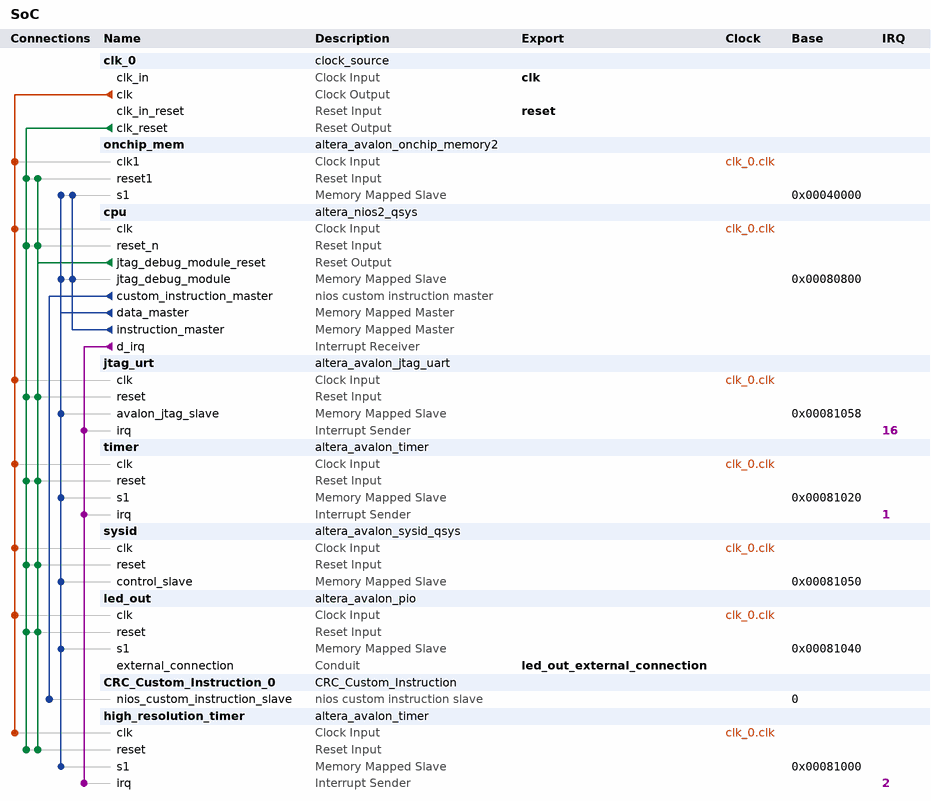
[diagram p0: system contents]
# Platform Designer (Qsys) system SoC, Cyclone IV E EP4CE115F29C7
# Parameters at their usual value, and those the tool derives, are not listed.
package require -exact qsys 12.1
create_system SoC
set_project_property DEVICE_FAMILY {Cyclone IV E}
set_project_property DEVICE EP4CE115F29C7

add_instance clk_0 clock_source 12.1
set_instance_parameter_value clk_0 clockFrequency 50000000

add_instance onchip_mem altera_avalon_onchip_memory2 12.1
set_instance_parameter_value onchip_mem dataWidth 32
set_instance_parameter_value onchip_mem dualPort false
set_instance_parameter_value onchip_mem initMemContent true
set_instance_parameter_value onchip_mem initializationFileName onchip_mem
set_instance_parameter_value onchip_mem memorySize 262144

add_instance cpu altera_nios2_qsys 12.1
set_instance_parameter_value cpu resetSlave onchip_mem.s1
set_instance_parameter_value cpu exceptionSlave onchip_mem.s1
set_instance_parameter_value cpu breakSlave cpu.jtag_debug_module
set_instance_parameter_value cpu muldiv_multiplierType NoneSmall
set_instance_parameter_value cpu impl Small
set_instance_parameter_value cpu icache_size 4096

add_instance jtag_urt altera_avalon_jtag_uart 12.1
set_instance_parameter_value jtag_urt simInteractiveOptions INTERACTIVE_ASCII_OUTPUT

add_instance timer altera_avalon_timer 12.1
set_instance_parameter_value timer period 1
set_instance_parameter_value timer periodUnits MSEC
set_instance_parameter_value timer timerPreset CUSTOM

add_instance sysid altera_avalon_sysid_qsys 12.1
set_instance_parameter_value sysid id 0

add_instance led_out altera_avalon_pio 12.1
set_instance_parameter_value led_out direction Output
set_instance_parameter_value led_out width 8

add_instance CRC_Custom_Instruction_0 CRC_Custom_Instruction 1.0
set_instance_parameter_value CRC_Custom_Instruction_0 crc_width 32
set_instance_parameter_value CRC_Custom_Instruction_0 polynomial_inital 4294967295
set_instance_parameter_value CRC_Custom_Instruction_0 polynomial 79764919
set_instance_parameter_value CRC_Custom_Instruction_0 reflected_input 1
set_instance_parameter_value CRC_Custom_Instruction_0 reflected_output 1
set_instance_parameter_value CRC_Custom_Instruction_0 xor_output 4294967295

add_instance high_resolution_timer altera_avalon_timer 12.1
set_instance_parameter_value high_resolution_timer period 1
set_instance_parameter_value high_resolution_timer periodUnits USEC
set_instance_parameter_value high_resolution_timer timerPreset CUSTOM

# connections
add_connection clk_0.clk cpu.clk clock
add_connection clk_0.clk high_resolution_timer.clk clock
add_connection clk_0.clk jtag_urt.clk clock
add_connection clk_0.clk led_out.clk clock
add_connection clk_0.clk onchip_mem.clk1 clock
add_connection clk_0.clk sysid.clk clock
add_connection clk_0.clk timer.clk clock
add_connection clk_0.clk_reset cpu.reset_n reset
add_connection clk_0.clk_reset high_resolution_timer.reset reset
add_connection clk_0.clk_reset jtag_urt.reset reset
add_connection clk_0.clk_reset led_out.reset reset
add_connection clk_0.clk_reset onchip_mem.reset1 reset
add_connection clk_0.clk_reset sysid.reset reset
add_connection clk_0.clk_reset timer.reset reset
add_connection cpu.jtag_debug_module_reset cpu.reset_n reset
add_connection cpu.jtag_debug_module_reset high_resolution_timer.reset reset
add_connection cpu.jtag_debug_module_reset jtag_urt.reset reset
add_connection cpu.jtag_debug_module_reset led_out.reset reset
add_connection cpu.jtag_debug_module_reset onchip_mem.reset1 reset
add_connection cpu.jtag_debug_module_reset sysid.reset reset
add_connection cpu.jtag_debug_module_reset timer.reset reset
add_connection cpu.data_master cpu.jtag_debug_module avalon
set_connection_parameter_value cpu.data_master/cpu.jtag_debug_module baseAddress 0x00080800
add_connection cpu.data_master high_resolution_timer.s1 avalon
set_connection_parameter_value cpu.data_master/high_resolution_timer.s1 baseAddress 0x00081000
add_connection cpu.data_master jtag_urt.avalon_jtag_slave avalon
set_connection_parameter_value cpu.data_master/jtag_urt.avalon_jtag_slave baseAddress 0x00081058
add_connection cpu.data_master led_out.s1 avalon
set_connection_parameter_value cpu.data_master/led_out.s1 baseAddress 0x00081040
add_connection cpu.data_master onchip_mem.s1 avalon
set_connection_parameter_value cpu.data_master/onchip_mem.s1 baseAddress 0x00040000
add_connection cpu.data_master sysid.control_slave avalon
set_connection_parameter_value cpu.data_master/sysid.control_slave baseAddress 0x00081050
add_connection cpu.data_master timer.s1 avalon
set_connection_parameter_value cpu.data_master/timer.s1 baseAddress 0x00081020
add_connection cpu.instruction_master cpu.jtag_debug_module avalon
set_connection_parameter_value cpu.instruction_master/cpu.jtag_debug_module baseAddress 0x00080800
add_connection cpu.instruction_master onchip_mem.s1 avalon
set_connection_parameter_value cpu.instruction_master/onchip_mem.s1 baseAddress 0x00040000
add_connection cpu.d_irq high_resolution_timer.irq interrupt
set_connection_parameter_value cpu.d_irq/high_resolution_timer.irq irqNumber 2
add_connection cpu.d_irq jtag_urt.irq interrupt
set_connection_parameter_value cpu.d_irq/jtag_urt.irq irqNumber 16
add_connection cpu.d_irq timer.irq interrupt
set_connection_parameter_value cpu.d_irq/timer.irq irqNumber 1
add_connection cpu.custom_instruction_master CRC_Custom_Instruction_0.nios_custom_instruction_slave nios_custom_instruction
set_connection_parameter_value cpu.custom_instruction_master/CRC_Custom_Instruction_0.nios_custom_instruction_slave CIName crc_custom_instruction_0
set_connection_parameter_value cpu.custom_instruction_master/CRC_Custom_Instruction_0.nios_custom_instruction_slave baseAddress 0

# exported interfaces
add_interface clk clock sink
set_interface_property clk EXPORT_OF clk_0.clk_in
add_interface reset reset sink
set_interface_property reset EXPORT_OF clk_0.clk_in_reset
add_interface led_out_external_connection conduit end
set_interface_property led_out_external_connection EXPORT_OF led_out.external_connection

save_system SoC.qsys
